# EAGLE schematic dispa (EAGLE 5.10)
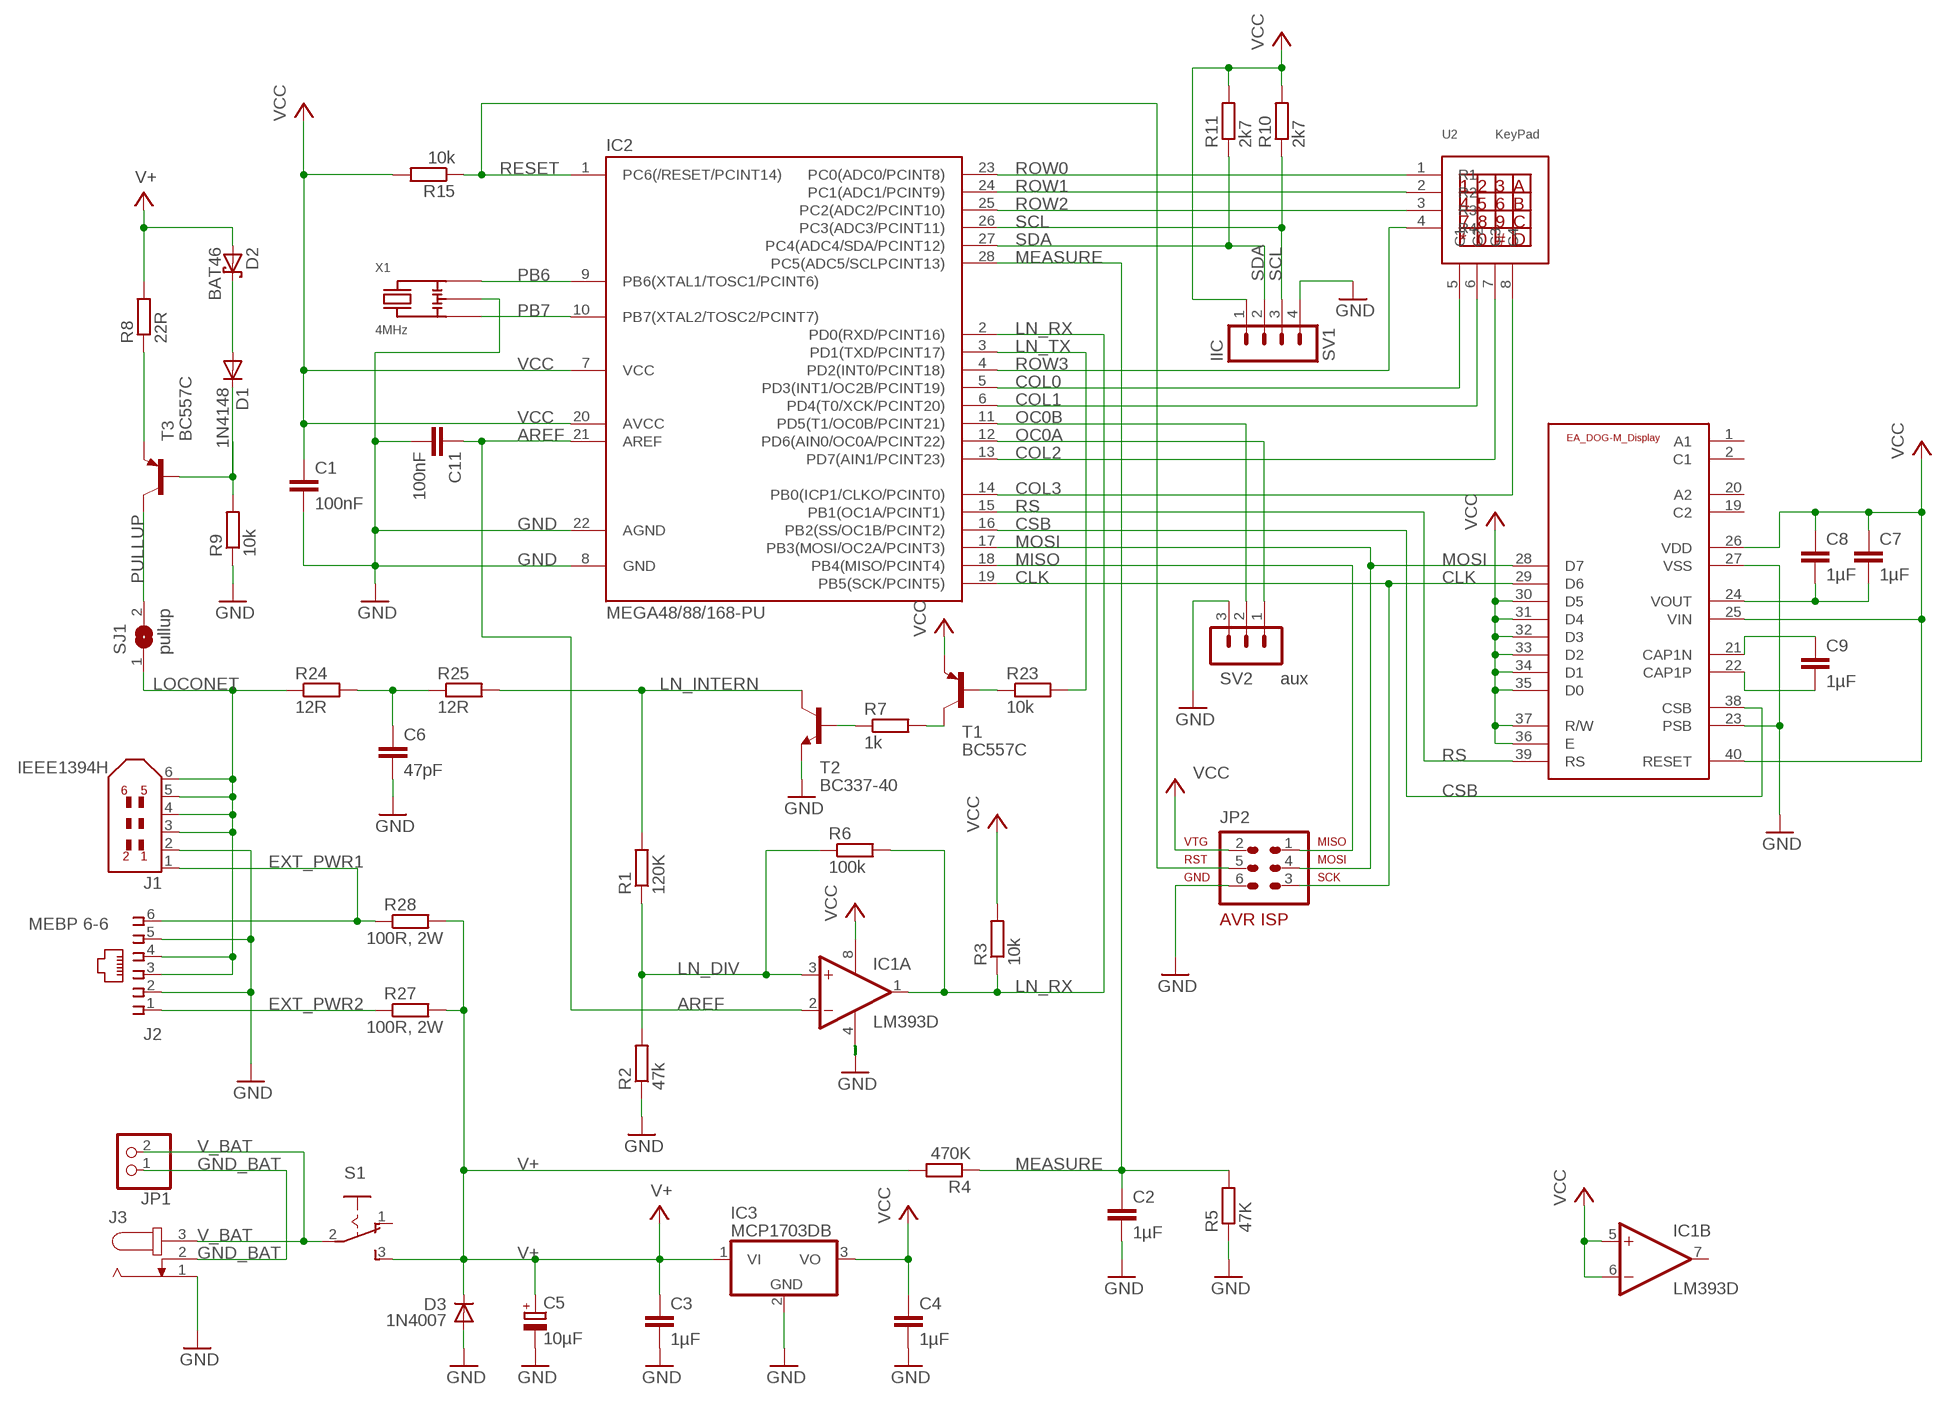
[diagram p0: schematic, sheet 1]

## Parts
C1  100nF  C-EUC1206  [C1206]
C2  1µF  C-EUC1206  [C1206]
C3  1µF  C-EUC1206  [C1206]
C4  1µF  C-EUC1206  [C1206]
C5  10µF  CPOL-EUE2.5-7  [E2,5-7]
C6  47pF  C-EUC1206  [C1206]
C7  1µF  C-EUC1206  [C1206]
C8  1µF  C-EUC1206  [C1206]
C9  1µF  C-EUC1206  [C1206]
C11  100nF  C-EUC1206  [C1206]
D1  1N4148  1N4148DO35-7  [DO35-7]
D2  BAT46  BAT19  [DO35-10]
D3  1N4007  1N4004  [DO41-10]
IC1  LM393D  [SO08]
IC2  MEGA48/88/168-PU  [DIL28-3]
IC3  MCP1703DB  [SOT223]
J1  IEEE1394H  IEEE1394_6P-85-32007-10X-1  [85-32007-10X-1]
J2  MEBP 6-6  520425-3  [520425-3]
J3  JACK-PLUG1  [SPC4078]
JP1  PINHD-1X2  [1X02]
JP2  AVR-ISP-6W  [ML6]
R1  120K  R-EU_R1206  [R1206]
R2  47k  R-EU_R1206  [R1206]
R3  10k  R-EU_R1206  [R1206]
R4  470K  R-EU_R1206  [R1206]
R5  47K  R-EU_R1206  [R1206]
R6  100k  R-EU_R1206  [R1206]
R7  1k  R-EU_R1206  [R1206]
R8  22R  R-EU_R1206  [R1206]
R9  10k  R-EU_R1206  [R1206]
R10  2k7  R-EU_R1206  [R1206]
R11  2k7  R-EU_R1206  [R1206]
R15  10k  R-EU_R1206  [R1206]
R23  10k  R-EU_R1206  [R1206]
R24  12R  R-EU_R1206  [R1206]
R25  12R  R-EU_R1206  [R1206]
R27  100R, 2W  R-EU_0617/22  [0617/22]
R28  100R, 2W  R-EU_0617/22  [0617/22]
S1  M251  [M251]
SJ1  pullup  SJ  [SJ]
SV1  IIC  MA04-1  [MA04-1]
SV2  aux  MA03-1  [MA03-1]
T1  BC557C  BC327  [TO92]
T2  BC337-40  BC337  [TO92]
T3  BC557C  BC327  [TO92]
U1  EA_DOG-M_DISPLAY  [E_DOG-M_DISPLAY]
U2  KeyPad  KEYPAD4X4  [KEYPAD4X4]
X1  4MHz  RESONATOR  [RESONATOR_TH]

## Nets
AREF: C11.1 IC1.2(A:-IN) IC2.21(AREF)
CLK: IC2.19(PB5(SCK/PCINT5)) JP2.3 U1.29(D6)
COL0: IC2.5(PD3(INT1/OC2B/PCINT19)) U2.5(C1)
COL1: IC2.6(PD4(T0/XCK/PCINT20)) U2.6(C2)
COL2: IC2.13(PD7(AIN1/PCINT23)) U2.7(C3)
COL3: IC2.14(PB0(ICP1/CLKO/PCINT0)) U2.8(C4)
CSB: IC2.16(PB2(SS/OC1B/PCINT2)) U1.38(CSB)
EXT_PWR1: J1.1 J2.6 R28.1
EXT_PWR2: J2.1 R27.1
GND: C1.2 C2.2 C3.2 C4.2 C5.- C6.2 C11.2 D3.A IC1.4(P:V-) IC2.8(GND) IC2.22(AGND) IC3.2(GND) J1.2 J2.2 J2.5 J3.1 JP2.6 R2.1 R5.1 R9.1 SV1.4 SV2.3 T2.1(E) U1.23(PSB) U1.27(VSS) X1.2
GND_BAT: J3.2 JP1.1
LN_CAP: C6.1 R24.2 R25.1
LN_DIV: IC1.3(A:+IN) R1.1 R2.2 R6.1
LN_INTERN: R1.2 R25.2 T2.3(C)
LN_RX: IC1.1(A:OUT) IC2.2(PD0(RXD/PCINT16)) R3.1 R6.2
LN_TX: IC2.3(PD1(TXD/PCINT17)) R23.2
LOCONET: J1.3 J1.4 J1.5 J1.6 J2.3 J2.4 R24.1 SJ1.1
MEASURE: C2.1 IC2.28(PC5(ADC5/SCLPCINT13)) R4.1 R5.2
MISO: IC2.18(PB4(MISO/PCINT4)) JP2.1
MOSI: IC2.17(PB3(MOSI/OC2A/PCINT3)) JP2.4 U1.28(D7)
N$1: C9.1 U1.21(CAP1N)
N$3: C9.2 U1.22(CAP1P)
N$5: R23.1 T1.2(B)
N$7: R7.2 T1.3(C)
N$8: R7.1 T2.2(B)
N$9: R8.1 T3.1(E)
N$10: D1.C R9.2 T3.2(B)
N$11: D1.A D2.C
OC0A: IC2.12(PD6(AIN0/OC0A/PCINT22)) SV2.1
OC0B: IC2.11(PD5(T1/OC0B/PCINT21)) SV2.2
PB6: IC2.9(PB6(XTAL1/TOSC1/PCINT6)) X1.1
PB7: IC2.10(PB7(XTAL2/TOSC2/PCINT7)) X1.3
PULLUP: SJ1.2 T3.3(C)
RESET: IC2.1(PC6(/RESET/PCINT14)) JP2.5 R15.1
ROW0: IC2.23(PC0(ADC0/PCINT8)) U2.1(R1)
ROW1: IC2.24(PC1(ADC1/PCINT9)) U2.2(R2)
ROW2: IC2.25(PC2(ADC2/PCINT10)) U2.3(R3)
ROW3: IC2.4(PD2(INT0/PCINT18)) U2.4(R4)
RS: IC2.15(PB1(OC1A/PCINT1)) U1.39(RS)
SCL: IC2.26(PC3(ADC3/PCINT11)) R10.1 SV1.3
SDA: IC2.27(PC4(ADC4/SDA/PCINT12)) R11.1 SV1.2
V+: C3.1 C5.+ D2.A D3.C IC3.1(VI) R4.2 R8.2 R27.2 R28.2 S1.3(S)
V_BAT: J3.3 JP1.2 S1.2(P)
VCC: C1.1 C4.1 C7.1 C8.1 IC1.5(B:+IN) IC1.6(B:-IN) IC1.8(P:V+) IC2.7(VCC) IC2.20(AVCC) IC3.3(VO) JP2.2 R3.2 R10.2 R11.2 R15.2 SV1.1 T1.1(E) U1.25(VIN) U1.26(VDD) U1.30(D5) U1.31(D4) U1.32(D3) U1.33(D2) U1.34(D1) U1.35(D0) U1.36(E) U1.37(R/W) U1.40(RESET)
VOUT: C7.2 C8.2 U1.24(VOUT)
Unconnected: IC1.7(B:OUT) J1.M1(S1) J1.M2(S2) S1.1(O) U1.1(A1) U1.2(C1) U1.19(C2) U1.20(A2)

## Library data of the parts
C1-C4 C6-C9 C11 = rcl:C-EU: CAPACITOR, European symbol
C5 = rcl:CPOL-EU: POLARIZED CAPACITOR, European symbol
D1 = diode:1N4148: DIODE high speed (Philips)
D2 = diode:BAT19: DIODE barrier diode
D3 = diode:1N4004: DIODE general purpose rectifier, 1 A
IC1 = linear:LM393: COMPARATOR
IC2 = avr-6:MEGA48/88/168-PU
IC3 = linear:MCP1703: 250 mA, 16V, Low Quiescent Current LDO Regulator Source: http://ww1.microchip.com/downloads/en/DeviceDoc/22049b.pdf
J1 = con-cypressindustries:IEEE1394_6P-: IEEE1394 6P Firewire Receptacle Source: www.cypressindustries.com
J2 = con-amp:520425-3: AMP connector
J3 = con-jack:JACK-PLUG: DC POWER JACK Power Jack, DC, Right Angle, Through Hole, Rated 5A at 16VDC, PC Terminals Distributor: Farnell (www.Farnell.de) Drawing: 84N1161.pdf / 84N1162.pdf Manufacturer: SPC Technology (www.spctechnology.com) Type: SPC4077 / SPC 4078
JP1 = pinhead:PINHD-1X2: PIN HEADER
JP2 = sbor:AVR-ISP-6: AVR ISP-6 Serial Programming Header
R1-R11 R15 R23-R25 R27 R28 = rcl:R-EU_: RESISTOR, European symbol
S1 = switch:M251: SLIDING SWITCH Mors, distributor Buerklin, 11G702
SJ1 = jumper:SJ: SMD solder JUMPER
SV1 = con-lstb:MA04-1: PIN HEADER
SV2 = con-lstb:MA03-1: PIN HEADER
T1 T3 = transistor-pnp:BC327: PNP Transistor
T2 = transistor:BC337: NPN TRANSISTOR
U1 = display_ea_dog-m:EA_DOG-M_DISPLAY
U2 = keypad4x4_ece:KEYPAD4X4
X1 = sbor:RESONATOR